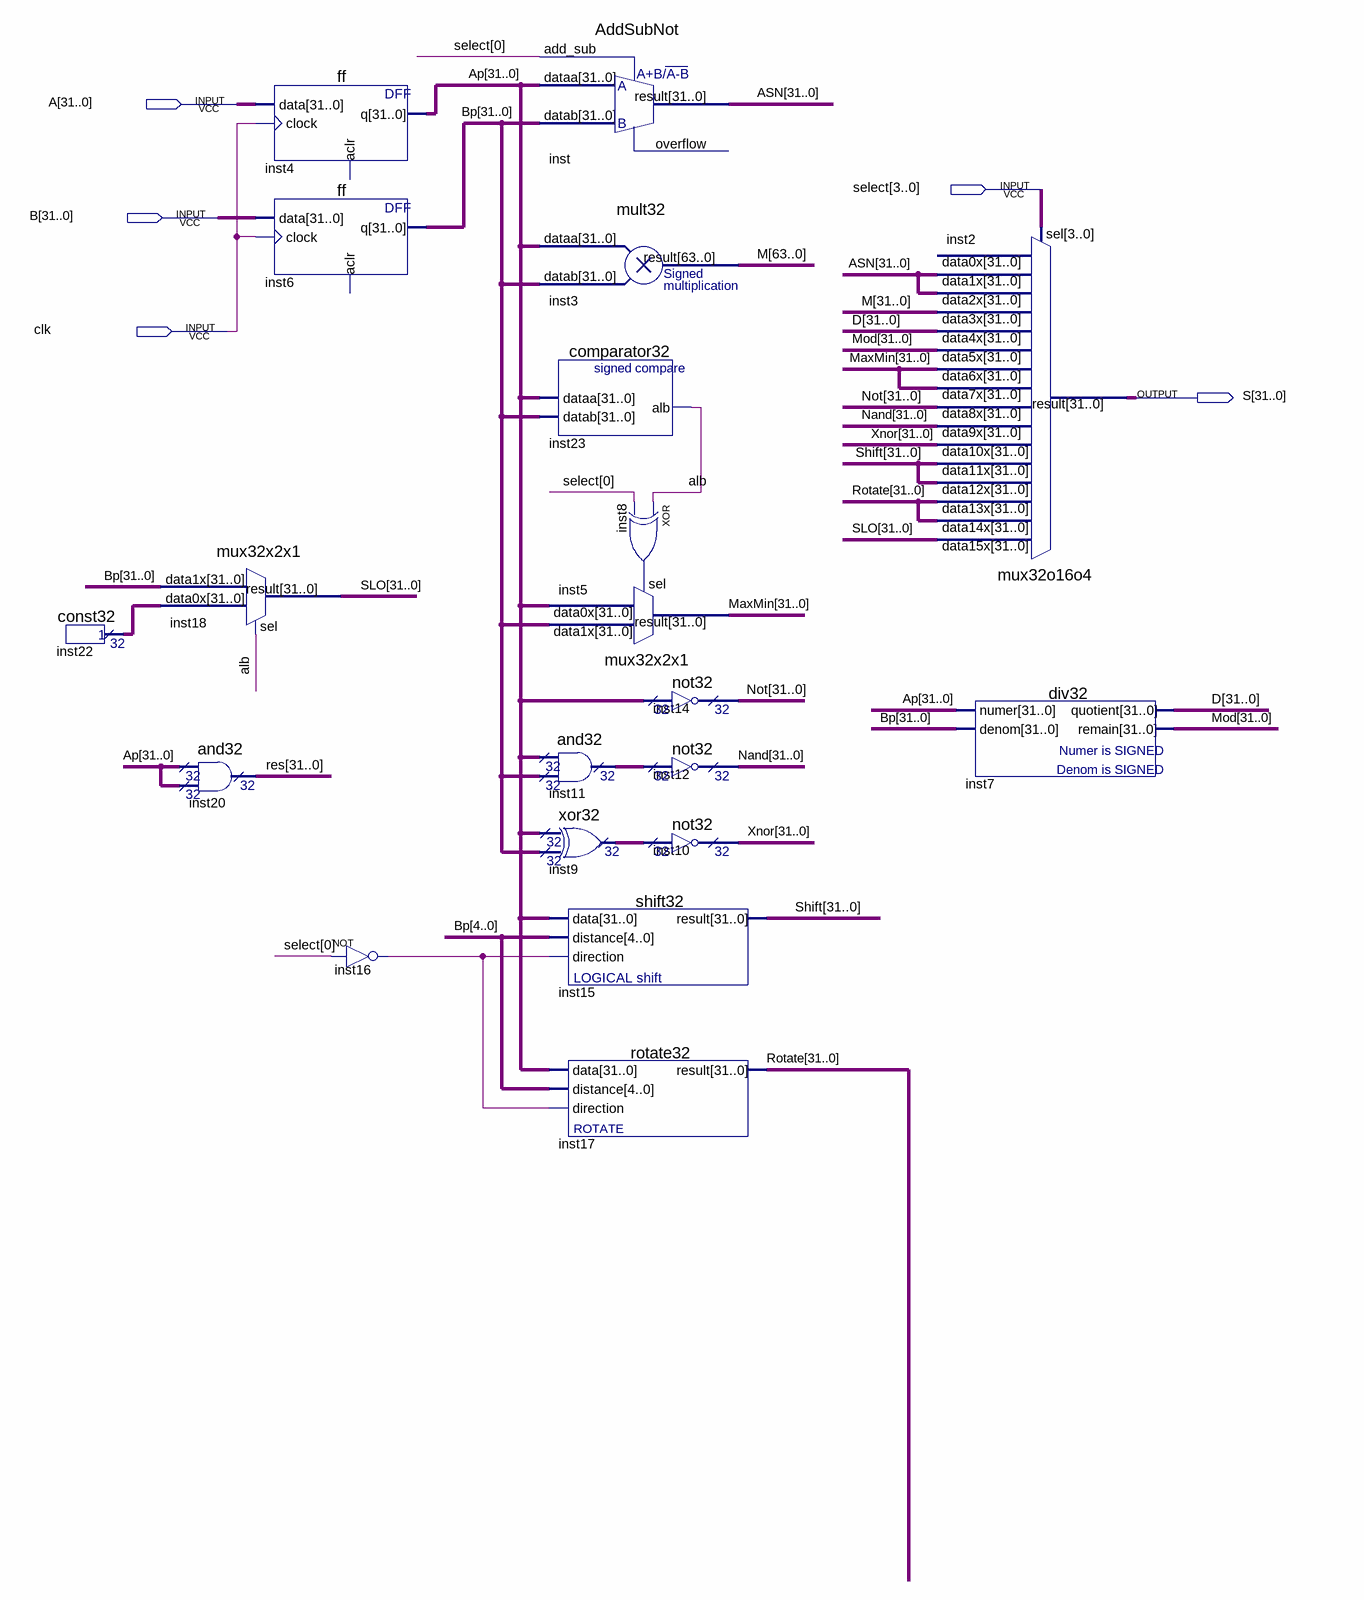
[diagram p0: schematic sheet]
// Quartus schematic ALU.bdf as structural Verilog: 20 symbols, 5 pins
module ALU (
  input  [31:0] A,
  input  [3:0] select,
  input  [31:0] B,
  input  clk,
  output [31:0] S
);

  wire alb, inst8_out, inst16_out;
  wire [31:0] Ap, ASN, Bp, D, inst9_result, inst11_result, inst22_result, MaxMin, Mod, Nand, Not, res,
       Rotate, Shift, SLO, Xnor;
  wire [63:0] M;

  const32 inst22 (.result(inst22_result));
  mux32x2x1 inst18 (.data1x(Bp), .data0x(inst22_result), .sel(alb), .result(SLO));
  and32 inst20 (.data0x(Ap), .data1x(Ap), .result(res));
  ff inst4 (.data(A), .clock(clk), .q(Ap));  // open: aclr
  ff inst6 (.data(B), .clock(clk), .q(Bp));  // open: aclr
  not inst16 (inst16_out, select[0]);
  AddSubNot inst (.dataa(Ap), .datab(Bp), .add_sub(select[0]), .result(ASN));  // open: overflow
  mult32 inst3 (.dataa(Ap), .datab(Bp), .result(M));
  comparator32 inst23 (.dataa(Ap), .datab(Bp), .alb(alb));
  mux32x2x1 inst5 (.data1x(Bp), .data0x(Ap), .sel(inst8_out), .result(MaxMin));
  and32 inst11 (.data0x(Ap), .data1x(Bp), .result(inst11_result));
  xor32 inst9 (.data0x(Ap), .data1x(Bp), .result(inst9_result));
  shift32 inst15 (.data(Ap), .distance(Bp[4:0]), .direction(inst16_out), .result(Shift));
  rotate32 inst17 (.data(Ap), .distance(Bp[4:0]), .direction(inst16_out), .result(Rotate));
  xor inst8 (inst8_out, alb, select[0]);
  not32 inst14 (.data(Ap), .result(Not));
  not32 inst12 (.data(inst11_result), .result(Nand));
  not32 inst10 (.data(inst9_result), .result(Xnor));
  mux32o16o4 inst2 (
    .data15x(SLO), .data14x(Rotate), .data13x(Rotate), .data12x(Shift), .data11x(Shift), .data10x(Xnor),
    .data9x(Nand), .data8x(Not), .data7x(MaxMin), .data6x(MaxMin), .data5x(Mod), .data4x(D),
    .data3x(M[31:0]), .data2x(ASN), .data1x(ASN), .sel(select), .result(S));  // open: data0x
  div32 inst7 (.numer(Ap), .denom(Bp), .quotient(D), .remain(Mod));
endmodule
